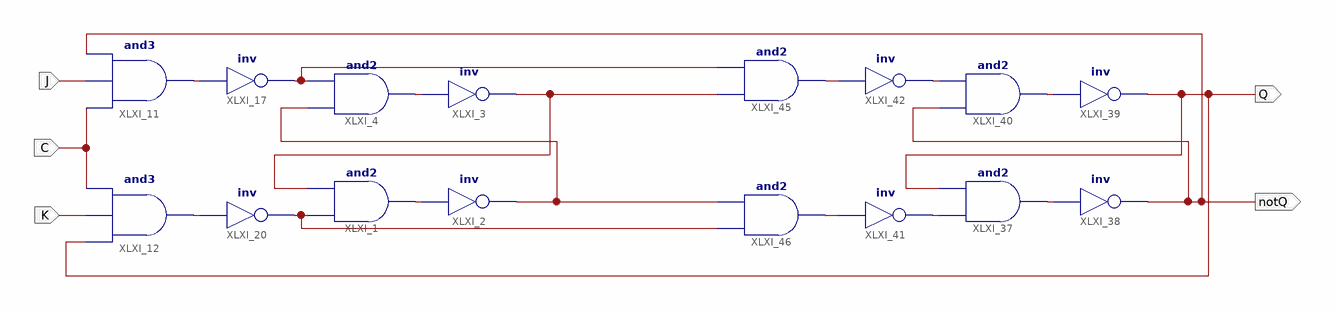
[diagram p0: schematic sheet 1]
// Xilinx ISE schematic scheme_pt4.sch (virtex5) as structural Verilog: 16 symbols, 5 ports
module scheme_pt4 (
  input  J,
  input  K,
  input  C,
  output notQ,
  output Q
);

  wire XLXN_18, XLXN_19, XLXN_63, XLXN_73, XLXN_101, XLXN_102, XLXN_103, XLXN_104, XLXN_105, XLXN_106,
       XLXN_113, XLXN_114, XLXN_123, XLXN_124;

  and XLXI_1 (XLXN_19, XLXN_124, XLXN_113);
  not XLXI_2 (XLXN_114, XLXN_19);
  not XLXI_3 (XLXN_113, XLXN_18);
  and XLXI_4 (XLXN_18, XLXN_114, XLXN_123);
  not XLXI_20 (XLXN_124, XLXN_73);
  not XLXI_17 (XLXN_123, XLXN_63);
  and XLXI_11 (XLXN_63, C, J, notQ);
  and XLXI_12 (XLXN_73, Q, K, C);
  and XLXI_37 (XLXN_102, XLXN_106, Q);
  not XLXI_38 (notQ, XLXN_102);
  not XLXI_39 (Q, XLXN_101);
  and XLXI_40 (XLXN_101, notQ, XLXN_103);
  not XLXI_41 (XLXN_106, XLXN_105);
  not XLXI_42 (XLXN_103, XLXN_104);
  and XLXI_45 (XLXN_104, XLXN_113, XLXN_123);
  and XLXI_46 (XLXN_105, XLXN_124, XLXN_114);
endmodule
